# Altium schematic sheet ECU_Interface.SchDoc
size A; SheetNumber: 2; SheetTotal: 3
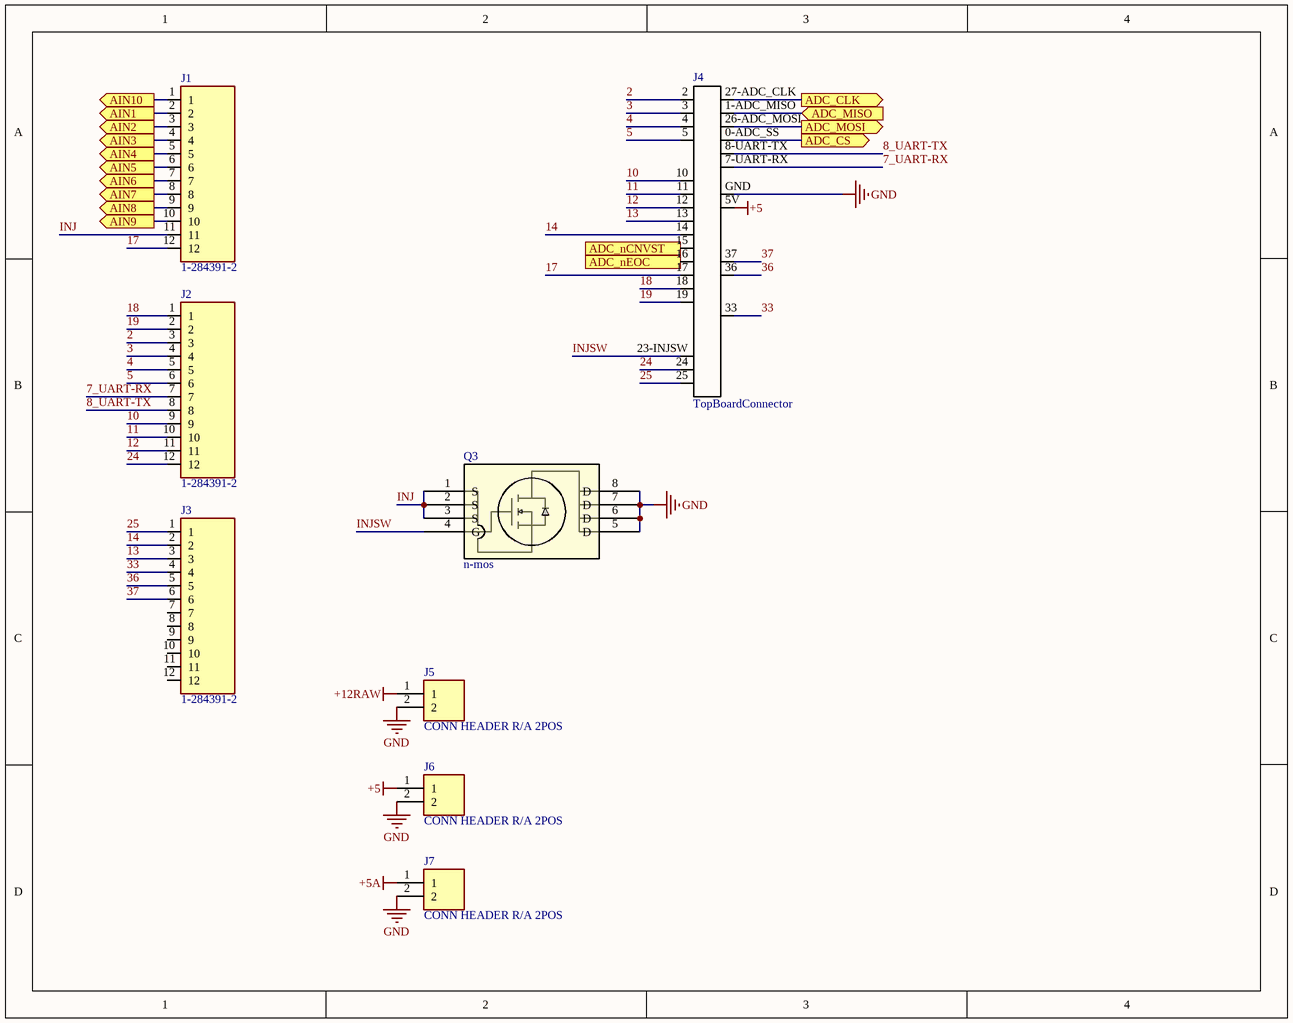
[diagram p0: ECU_Interface.SchDoc]

## Parts
J1  1-284391-2  [TE_1-284391-2]
J2  1-284391-2  [TE_1-284391-2]
J3  1-284391-2  [TE_1-284391-2]
J4  TopBoardConnector  [TopBoardConnector]
J5  CONN HEADER R/A 2POS  [2 POS MOLEX]
J6  CONN HEADER R/A 2POS  [2 POS MOLEX]
J7  CONN HEADER R/A 2POS  [2 POS MOLEX]
Q3  n-mos  [D0008A-IPC_A]

## Ports
ADC_CLK (out), ADC_CS (out), ADC_MISO (in), ADC_MOSI (out), ADC_nCNVST (out), ADC_nEOC (in), AIN1 (out), AIN2 (out), AIN3 (out), AIN4 (out), AIN5 (out), AIN6 (out), AIN7 (out), AIN8 (out), AIN9 (out), AIN10 (out)

## Nets
+5: J4.5V J6.1
+5A: J7.1
+12RAW: J5.1
GND: J4.GND J5.2 J6.2 J7.2 Q3.5(D) Q3.6(D) Q3.7(D) Q3.8(D)
2: J2.3 J4.2
3: J2.4 J4.3
4: J2.5 J4.4
5: J2.6 J4.5
7_UART-RX: J2.7 J4.7-UART-RX(8-UART-RX)
8_UART-TX: J2.8 J4.8-UART-TX
10: J2.9 J4.10
11: J2.10 J4.11
12: J2.11 J4.12
13: J3.3 J4.13
14: J3.2 J4.14
17: J1.12 J4.17
18: J2.1 J4.18
19: J2.2 J4.19
24: J2.12 J4.24
25: J3.1 J4.25
33: J3.4 J4.33
36: J3.5 J4.36
37: J3.6 J4.37
ADC_CLK: J4.27-ADC_CLK ; port ADC_CLK
ADC_CS: J4.0-ADC_SS ; port ADC_CS
ADC_MISO: J4.1-ADC_MISO ; port ADC_MISO
ADC_MOSI: J4.26-ADC_MOSI ; port ADC_MOSI
ADC_nCNVST: J4.15 ; port ADC_nCNVST
ADC_nEOC: J4.16 ; port ADC_nEOC
AIN1: J1.2 ; port AIN1
AIN2: J1.3 ; port AIN2
AIN3: J1.4 ; port AIN3
AIN4: J1.5 ; port AIN4
AIN5: J1.6 ; port AIN5
AIN6: J1.7 ; port AIN6
AIN7: J1.8 ; port AIN7
AIN8: J1.9 ; port AIN8
AIN9: J1.10 ; port AIN9
AIN10: J1.1 ; port AIN10
INJ: J1.11 Q3.1(S) Q3.2(S) Q3.3(S)
INJSW: J4.23-INJSW Q3.4(G)

Not connected (* = marked no-connect by the designer): J3 7 8 9 10 11 12

## Library data of the parts
J1-J3 = 1-284391-2: Conn Eurostyle Block F 12 POS 3.5mm Solder ST Thru-Hole 12A/Contact Box; MF: TE Connectivity; DigiKey-Purchase-URL: https://snapeda.com/shop?store=DigiKey&id=2875340; Arrow_Electronics-Purchase-URL: https://snapeda.com/shop?store=Arrow+Electronics&id=2875340; Price: None; Availability: Good; Value: *; MP: 1-284391-2; Package: None; Mouser-Purchase-URL: https://snapeda.com/shop?store=Mouser&id=2875340; SnapEDA_Link: https://www.snapeda.com/parts/1-284391-2/TE%20Connectivity%20AMP%20Connectors/view-part/2875340/?ref=snap
J4 = TopBoardConnector: Connection to the bottom board
J5-J7 = 1724480002: Manufacturer: Molex; Connector Type: Male Pin; Number of Circuits: 2; Row Spacing: 0.165inch; Glow Wire Compliant: Compliant; Supplier 1: Digi-Key; Manufacturer Part Number: 1724480002; RoHS: No; Category: Headers and Wire Housings; Stock 1: 6210; Pricing 1: 1=0.55000, 10=0.46000, 100=0.35780, 1000=0.28116, 5000=0.24708, 10000=0.23004 (USD); Mount: Through Hole; Number of Pins: 2; Contact Plating: Tin; Color: Black; Orientation: Right Angle; Packaging: Tray; Number of Positions: 2; Number of Rows: 2; Termination: Solder; Fastening Type: Ramp; ComponentLink1URL: https://www.molex.com/pdm_docs/sd/1724480002_sd.pdf?src-supplier=Digi-Key; ComponentLink1Description: https://www.molex.com/pdm_docs/sd/1724480002_sd.pdf?src-supplier=Digi-Key; Supplier Part Number 1: WM16206-ND
Q3 = DMN3007LSSQ-13: MOSFET MOSFETBVDSS: 25V-30V